# Altium schematic sheet LM60 - mul.SchDoc: LM60 temperature sensors
size A4; Author: Grzegorz Gajoch; DocumentNumber: 6; SheetNumber: 6; SheetTotal: 16; Model: EM1; PageSetup: Record=PageOptions|CenterHorizontal=True|CenterVertical=True|PrintScale=0.52|XCorrection=1.00|YCorrection=1.00|PrintKind=1|BorderSize=5000000|LeftOffset=0|BottomOffset=0|Orientation=2|PaperLength=4200|PaperWidth=2970|Scale=100|PaperSource=7|PrintQuality=600|MediaType=1|DitherType=10|PaperKind=A3|PrintScaleMode=1
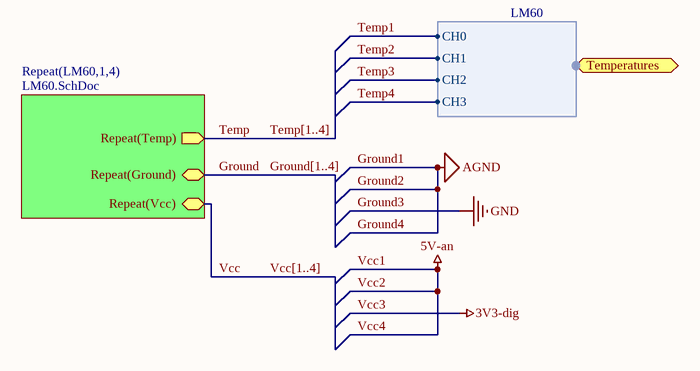
[diagram p0: LM60 - mul.SchDoc]

## Sub-sheets
Repeat(LM60,1,4) = LM60.SchDoc: Repeat(Temp) (out), Repeat(Ground), Repeat(Vcc)

## Ports
Temperatures (harness LM60)

## Harnesses
LM60: CH0, CH1, CH2, CH3

## Nets
Ground: sheet Repeat(LM60,1,4)/Repeat(Ground)
Temp: sheet Repeat(LM60,1,4)/Repeat(Temp)
Temp1: port Temperatures.CH0
Temp2: port Temperatures.CH1
Temp3: port Temperatures.CH2
Temp4: port Temperatures.CH3
Vcc: sheet Repeat(LM60,1,4)/Repeat(Vcc)

## Buses and harness runs
bus Ground[1..4]
bus Temp[1..4]
bus Vcc[1..4]

## Notes on the sheet
- Title:
- Sheet:
- of
- Author:
- Model:
- Document Number:
- Checked by:
- Iss-Rev:
- Approved by:
- Date:
- File name: